# Altium schematic sheet NIR-Spec-Motherboard-SCH_SH3_(02).SchDoc: SCHEMATIC
size 863 x 558 mm; DocumentNumber: NIR-Spec-3; SheetNumber: 3; SheetTotal: 3; PageSetup: Record=PageOptions|CenterHorizontal=True|CenterVertical=True|PrintScale=0.98|XCorrection=1.00|YCorrection=1.00|PrintKind=2|BorderSize=5000000|LeftOffset=0|BottomOffset=0|Orientation=2|PaperLength=1000|PaperWidth=1000|Scale=100|PaperSource=15|PrintQuality=1200|MediaType=1|DitherType=10|PaperKind=11 x 17|PrintScaleMode=1
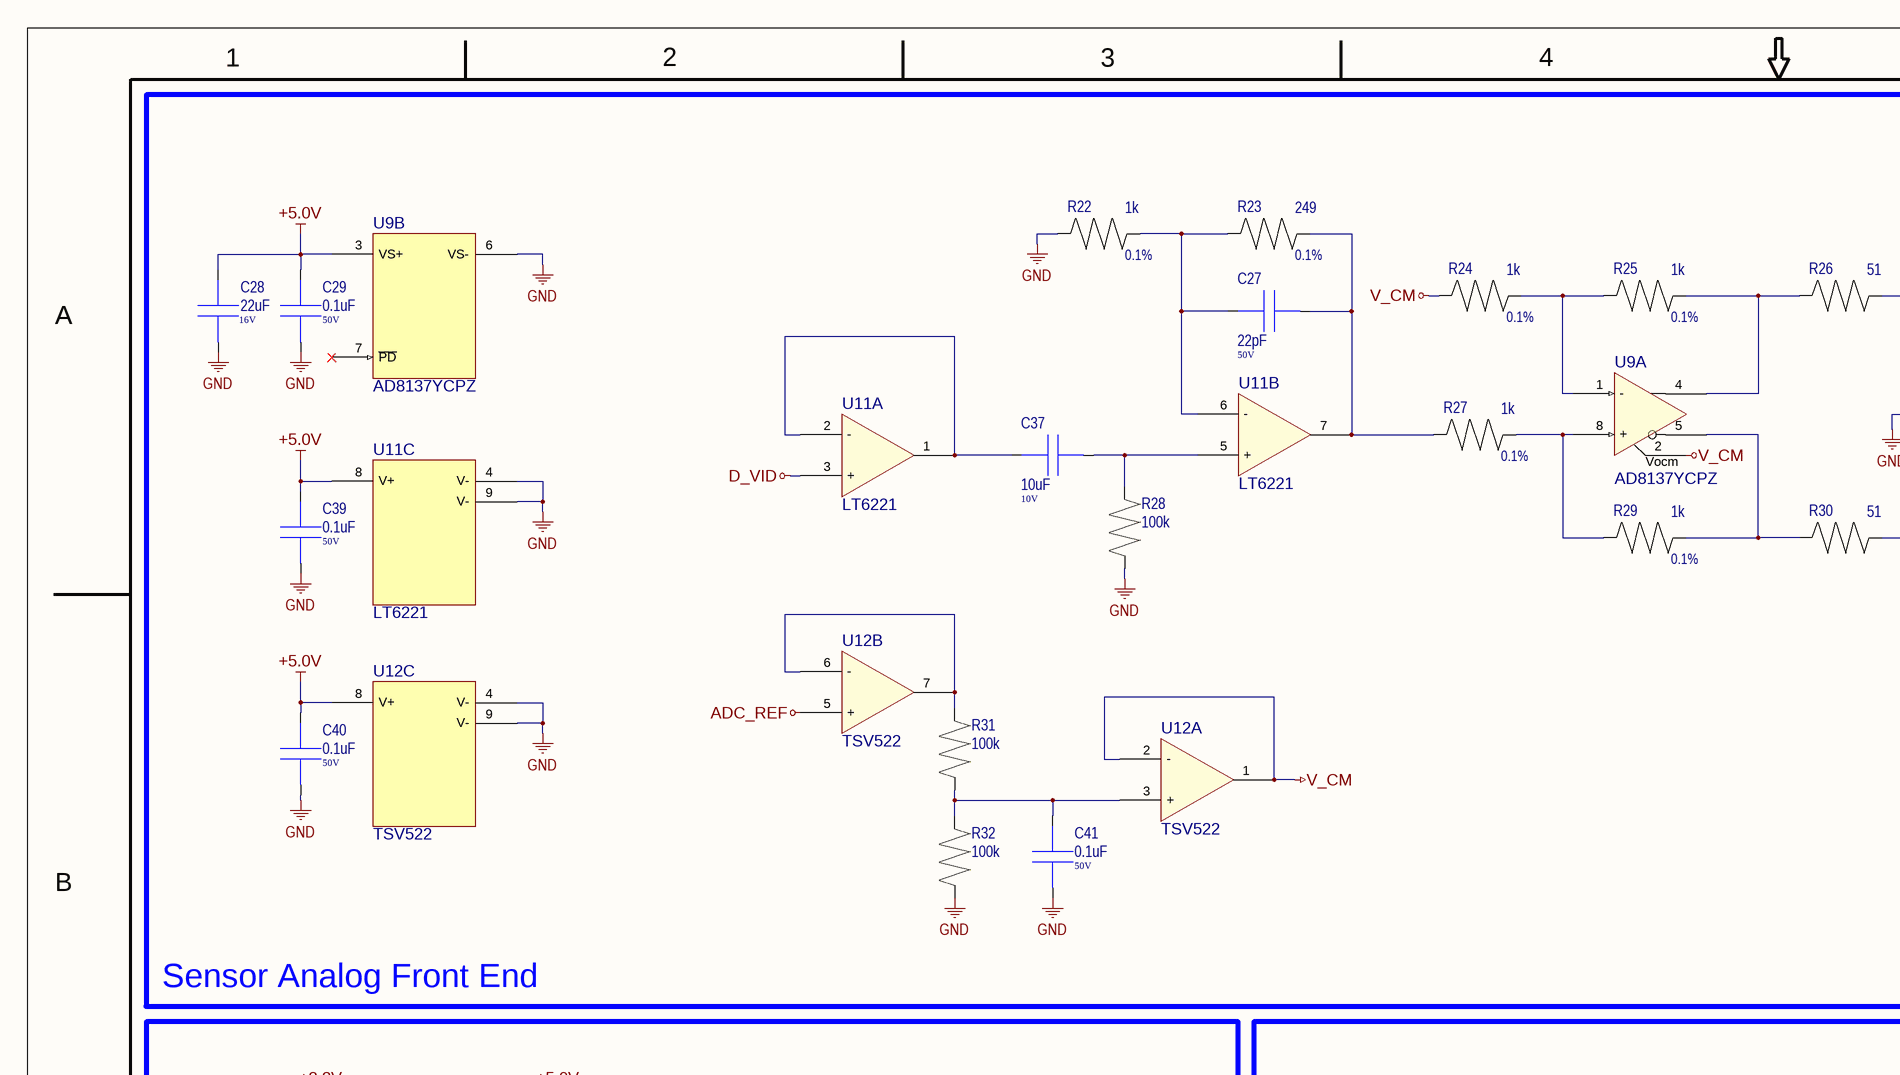
[diagram p0: NIR-Spec-Motherboard-SCH_SH3_(02).SchDoc, top left]
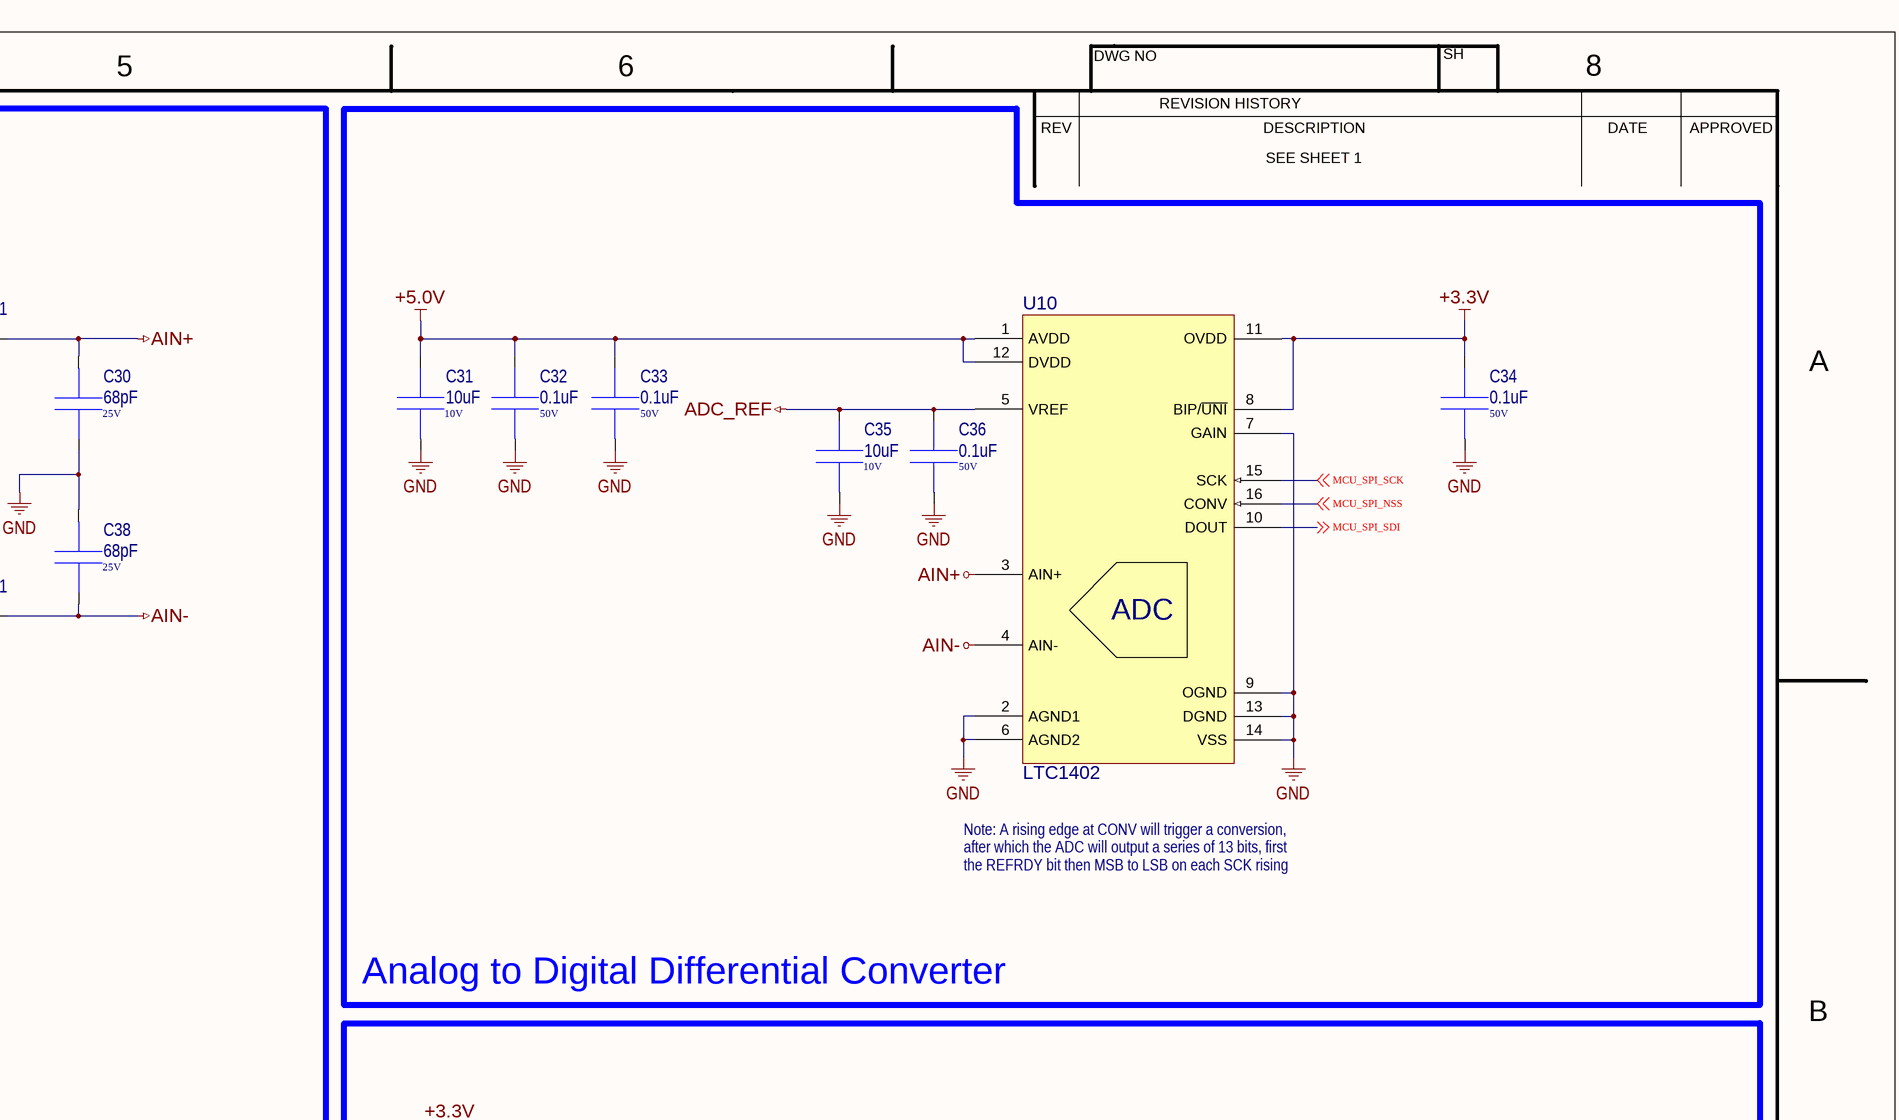
[diagram p1: NIR-Spec-Motherboard-SCH_SH3_(02).SchDoc, top right]
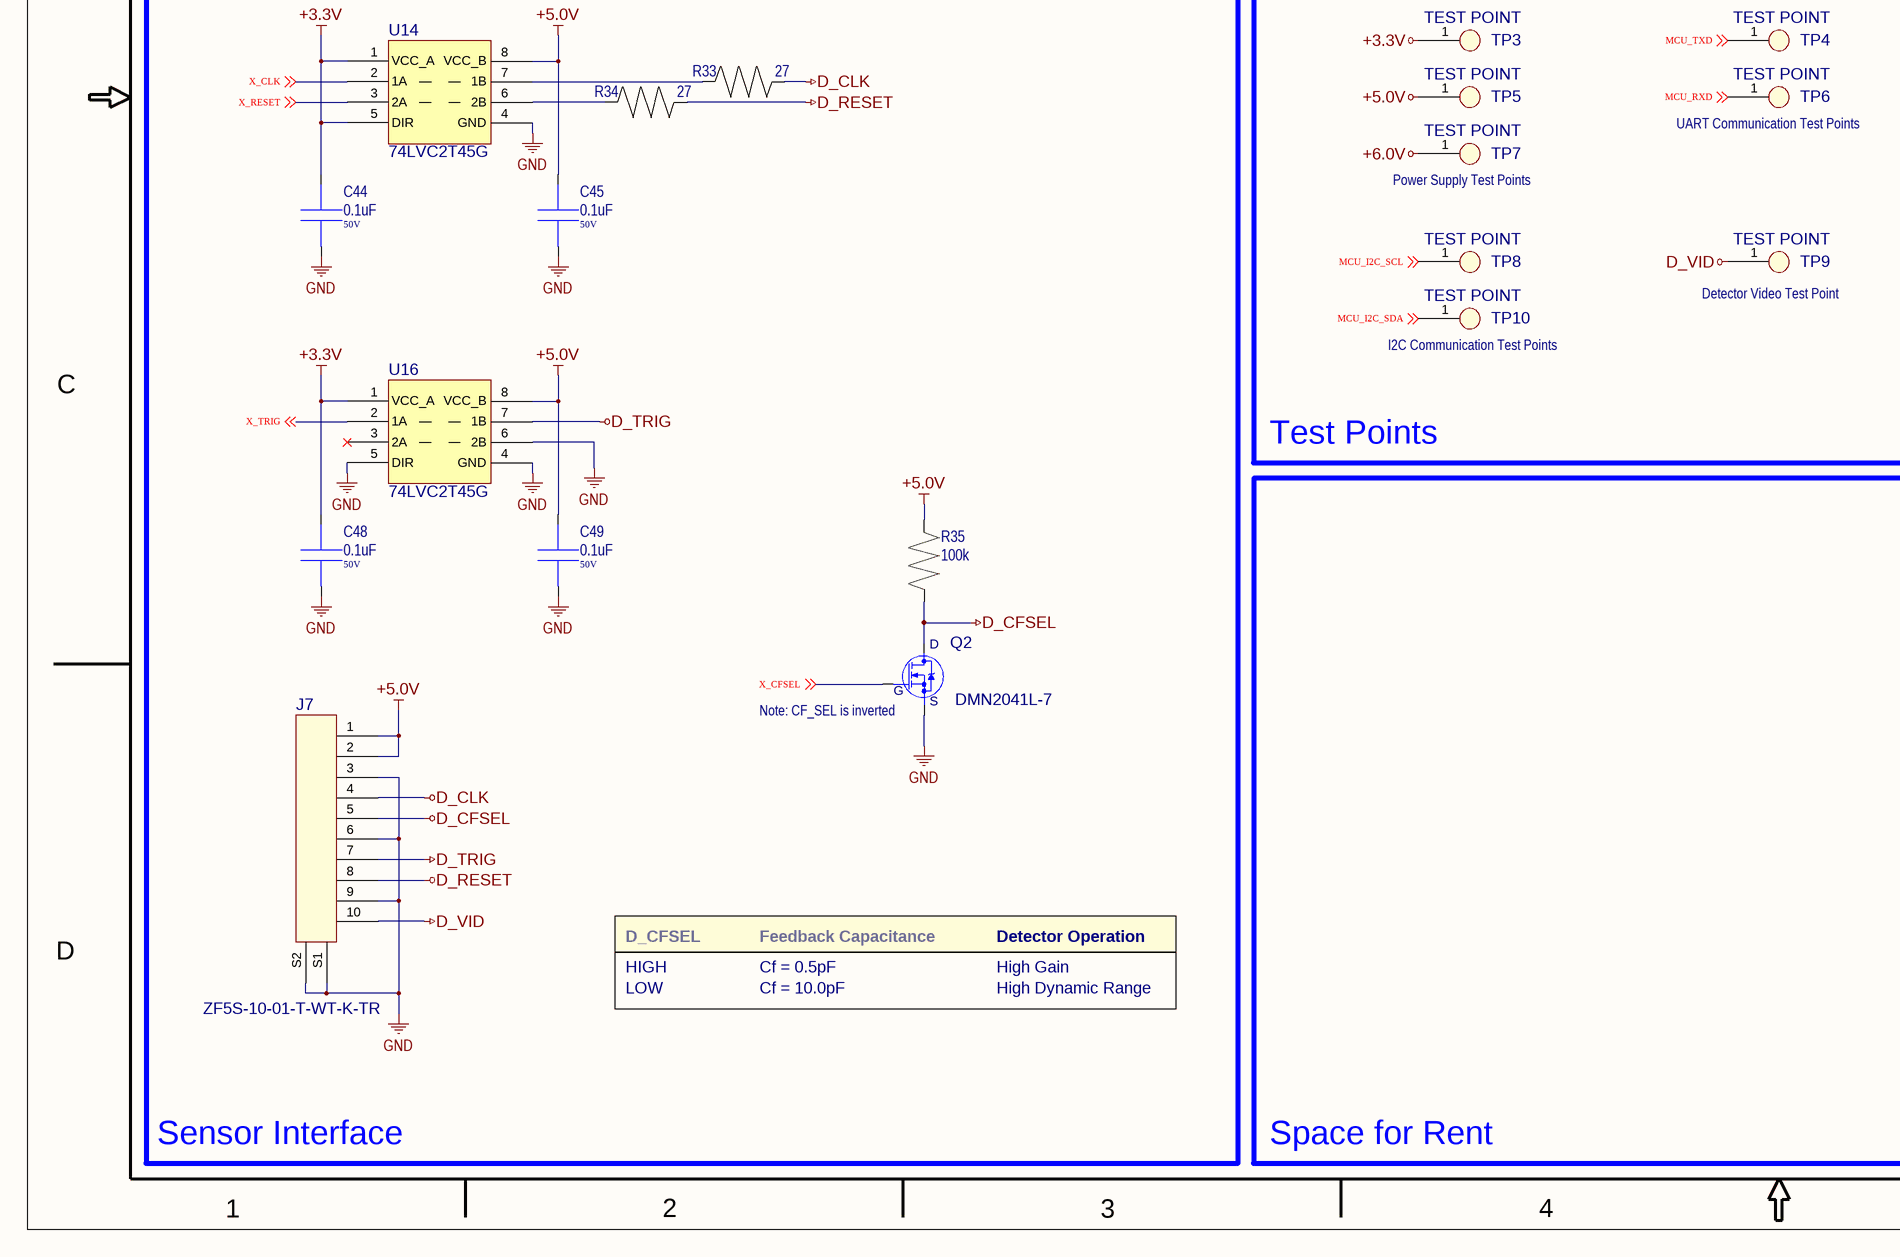
[diagram p2: NIR-Spec-Motherboard-SCH_SH3_(02).SchDoc, bottom left]
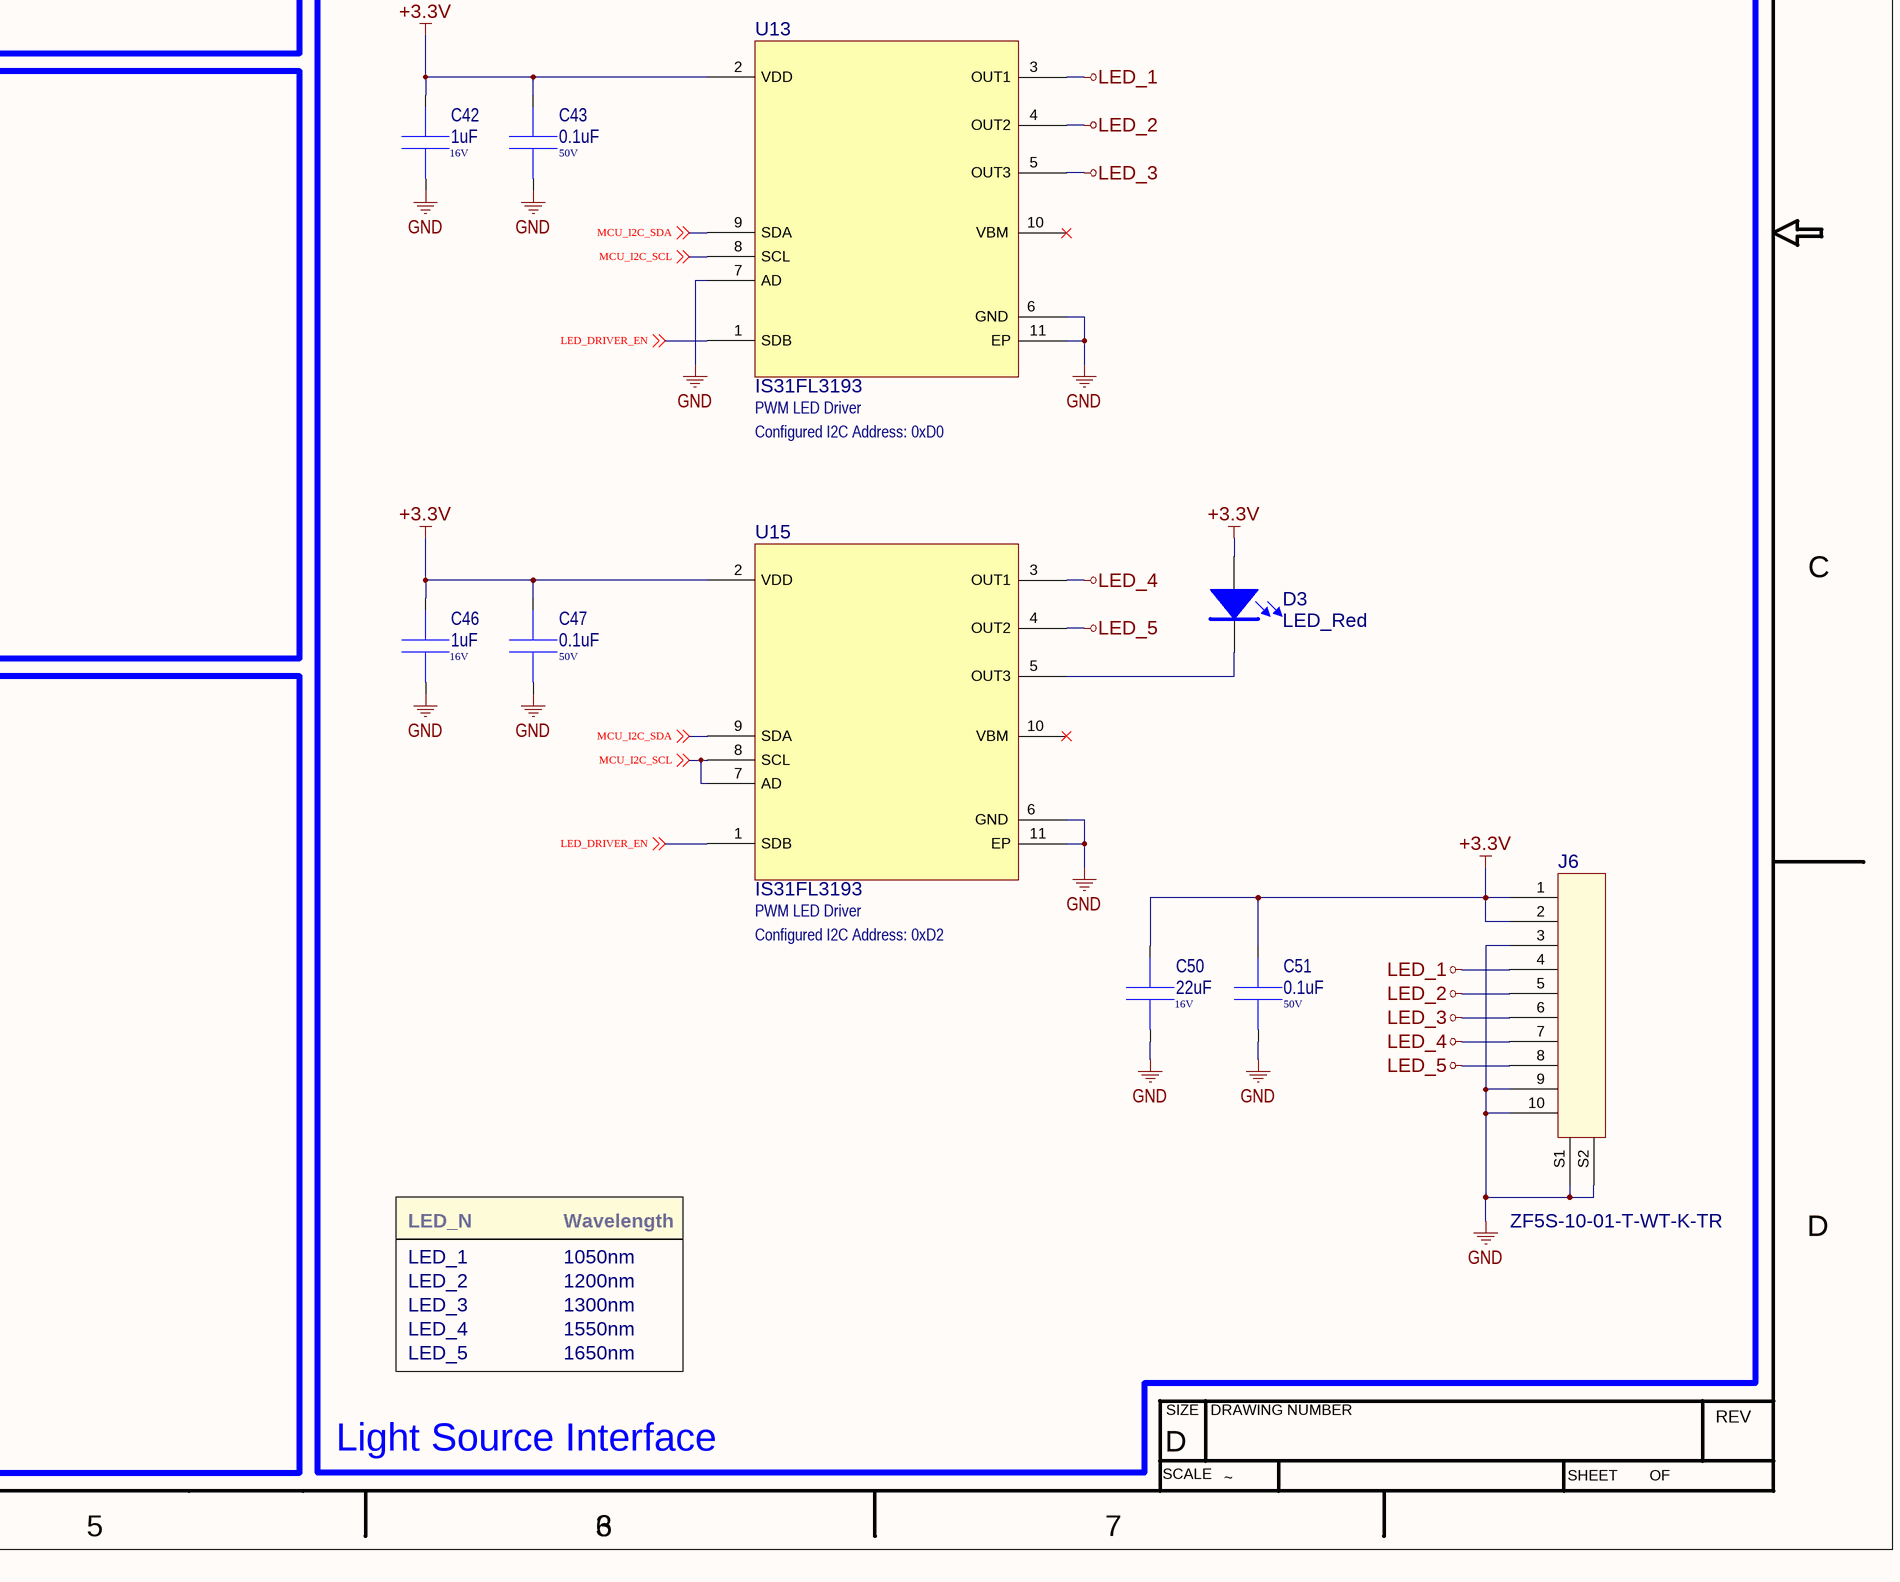
[diagram p3: NIR-Spec-Motherboard-SCH_SH3_(02).SchDoc, bottom right]

## Parts
C27  22pF  Voltage: 50V  [0603]
C28  22uF  Voltage: 16V  [0805]
C29  0.1uF  Voltage: 50V  [0603]
C30  68pF  Voltage: 25V  [0603]
C31  10uF  Voltage: 10V  [0603]
C32  0.1uF  Voltage: 50V  [0603]
C33  0.1uF  Voltage: 50V  [0603]
C34  0.1uF  Voltage: 50V  [0603]
C35  10uF  Voltage: 10V  [0603]
C36  0.1uF  Voltage: 50V  [0603]
C37  10uF  Voltage: 10V  [0603]
C38  68pF  Voltage: 25V  [0603]
C39  0.1uF  Voltage: 50V  [0603]
C40  0.1uF  Voltage: 50V  [0603]
C41  0.1uF  Voltage: 50V  [0603]
C42  1uF  Voltage: 16V  [0603]
C43  0.1uF  Voltage: 50V  [0603]
C44  0.1uF  Voltage: 50V  [0603]
C45  0.1uF  Voltage: 50V  [0603]
C46  1uF  Voltage: 16V  [0603]
C47  0.1uF  Voltage: 50V  [0603]
C48  0.1uF  Voltage: 50V  [0603]
C49  0.1uF  Voltage: 50V  [0603]
C50  22uF  Voltage: 16V  [0805]
C51  0.1uF  Voltage: 50V  [0603]
D3  LED_Red  [0603_LED_Red]
J6  ZF5S-10-01-T-WT-K-TR  [ZF5S-10-01-T-WT-K-TR]
J7  ZF5S-10-01-T-WT-K-TR  [ZF5S-10-01-T-WT-K-TR]
Q2  DMN2041L-7  [SOT-23]
R22  1k  [0603]
R23  249  [0603]
R24  1k  [0603]
R25  1k  [0603]
R26  51  [0603]
R27  1k  [0603]
R28  100k  [0603]
R29  1k  [0603]
R30  51  [0603]
R31  100k  [0603]
R32  100k  [0603]
R33  27  [0603]
R34  27  [0603]
R35  100k  [0603]
TP3  TEST POINT  [30x40 TP]
TP4  TEST POINT  [30x40 TP]
TP5  TEST POINT  [30x40 TP]
TP6  TEST POINT  [30x40 TP]
TP7  TEST POINT  [30x40 TP]
TP8  TEST POINT  [30x40 TP]
TP9  TEST POINT  [30x40 TP]
TP10  TEST POINT  [30x40 TP]
U9  AD8137YCPZ  [SOIC_8]  (parts A,B of 2)
U10  LTC1402  [LTC1402]
U11  LT6221  [DFN-8(3x3)]  (parts A,B,C of 3)
U12  TSV522  [DFN-8 2x2]  (parts A,B,C of 3)
U13  IS31FL3193  [DFN-10]
U14  74LVC2T45G  [SOT-765]
U15  IS31FL3193  [DFN-10]
U16  74LVC2T45G  [SOT-765]

## Blocks framed on the sheet
Sensor Analog Front End: C27-C30 C37-C41 R22-R32 U9 U11 U12
Analog to Digital Differential Converter: C31-C36 U10
Light Source Interface: C42 C43 C46 C47 C50 C51 D3 J6 U13 U15
Sensor Interface: C44 C45 C48 C49 J7 Q2 R33-R35 U14 U16
Test Points: TP3-TP10

## Nets
+3.3V: C34.2 C42.2 C43.2 C44.2 C46.2 C47.2 C48.2 C50.2 C51.2 D3.1(A) J6.1 J6.2 TP3.1 U10.8(BIP/~{UNI}) U10.11(OVDD) U13.2(VDD) U14.1(VCC_A) U14.5(DIR) U15.2(VDD) U16.1(VCC_A)
+5.0V: C28.2 C29.2 C31.2 C32.2 C33.2 C39.2 C40.2 C45.2 C49.2 J7.1 J7.2 R35.1 TP5.1 U9.3(VS+) U10.1(AVDD) U10.12(DVDD) U11.8(V+) U12.8(V+) U14.8(VCC_B) U16.8(VCC_B)
+6.0V: TP7.1
ADC_REF: C35.2 C36.2 U10.5(VREF) U12.5(+)
AIN+: C30.1 R26.2 U10.3(AIN+)
AIN-: C38.2 R30.2 U10.4(AIN-)
D_CFSEL: J7.5 Q2.2(D) R35.2
D_CLK: J7.4 R33.2
D_RESET: J7.8 R34.2
D_TRIG: J7.7 U16.7(1B)
D_VID: J7.10 TP9.1 U11.3(+)
GND: C28.1 C29.1 C30.2 C31.1 C32.1 C33.1 C34.1 C35.1 C36.1 C38.1 C39.1 C40.1 C41.1 C42.1 C43.1 C44.1 C45.1 C46.1 C47.1 C48.1 C49.1 C50.1 C51.1 J6.3 J6.9 J6.10 J6.S1 J6.S2 J7.3 J7.6 J7.9 J7.S1 J7.S2 Q2.3(S) R22.1 R28.2 R32.2 U9.6(VS-) U10.2(AGND1) U10.6(AGND2) U10.7(GAIN) U10.9(OGND) U10.13(DGND) U10.14(VSS) U11.4(V-) U11.9(V-) U12.4(V-) U12.9(V-) U13.6(GND) U13.7(AD) U13.11(EP) U14.4(GND) U15.6(GND) U15.11(EP) U16.4(GND) U16.5(DIR) U16.6(2B)
LED_1: J6.4 U13.3(OUT1)
LED_2: J6.5 U13.4(OUT2)
LED_3: J6.6 U13.5(OUT3)
LED_4: J6.7 U15.3(OUT1)
LED_5: J6.8 U15.4(OUT2)
V_CM: R24.1 U9.2(Vocm) U12.1(OUT) U12.2(-)
LED_DRIVER_EN: U13.1(SDB) U15.1(SDB) ; off-sheet LED_DRIVER_EN
MCU_I2C_SCL: TP8.1 U13.8(SCL) U15.7(AD) U15.8(SCL) ; off-sheet MCU_I2C_SCL
MCU_I2C_SDA: TP10.1 U13.9(SDA) U15.9(SDA) ; off-sheet MCU_I2C_SDA
MCU_RXD: TP6.1 ; off-sheet MCU_RXD
MCU_SPI_NSS: U10.16(CONV) ; off-sheet MCU_SPI_NSS
MCU_SPI_SCK: U10.15(SCK) ; off-sheet MCU_SPI_SCK
MCU_SPI_SDI: U10.10(DOUT) ; off-sheet MCU_SPI_SDI
MCU_TXD: TP4.1 ; off-sheet MCU_TXD
X_CFSEL: Q2.1(G) ; off-sheet X_CFSEL
X_CLK: U14.2(1A) ; off-sheet X_CLK
X_RESET: U14.3(2A) ; off-sheet X_RESET
X_TRIG: U16.2(1A) ; off-sheet X_TRIG
NetC27_1: C27.1 R23.2 R27.1 U11.7(OUT)
NetC27_2: C27.2 R22.2 R23.1 U11.6(-)
NetC37_1: C37.1 R28.1 U11.5(+)
NetC37_2: C37.2 U11.1(OUT) U11.2(-)
NetC41_2: C41.2 R31.2 R32.1 U12.3(+)
NetD3_2: D3.2(K) U15.5(OUT3)
NetR24_2: R24.2 R25.1 U9.1(-)
NetR25_2: R25.2 R26.1 U9.4(OUT+)
NetR27_2: R27.2 R29.1 U9.8(+)
NetR29_2: R29.2 R30.1 U9.5(OUT-)
NetR31_1: R31.1 U12.6(-) U12.7(OUT)
NetR33_1: R33.1 U14.7(1B)
NetR34_1: R34.1 U14.6(2B)

Not connected (* = marked no-connect by the designer): U9 7(~{PD})*; U13 10(VBM)*; U15 10(VBM)*; U16 3(2A)*

## Notes on the sheet
- 1
- 2
- 3
- 4
- 5
- 6
- DWG NO
- REVISION HISTORY
- SH
- 8
- REV
- DESCRIPTION
- SEE SHEET 1
- DATE
- APPROVED
- (near R22) 0.1%
- (near R23) 0.1%
- A
- (near R24) 0.1%
- (near R25) 0.1%
- (near R27) 0.1%
- (near R29) 0.1%
- Note: A rising edge at CONV will trigger a conversion,
- after which the ADC will output a series of 13 bits, first
- the REFRDY bit then MSB to LSB on each SCK rising
- B
- (near TP6) UART Communication Test Points
- (near TP7) Power Supply Test Points
- PWM LED Driver
- (near TP9) Detector Video Test Point
- Configured I2C Address: 0xD0
- (near TP10) I2C Communication Test Points
- C
- (near Q2) Note: CF_SEL is inverted
- Configured I2C Address: 0xD2
- D_CFSEL
- Feedback Capacitance
- Detector Operation
- D
- HIGH
- Cf = 0.5pF
- High Gain
- LED_1
- LED_N
- 1050nm
- Wavelength
- LOW
- Cf = 10.0pF
- High Dynamic Range
- LED_2
- LED_3
- LED_4
- 1200nm
- 1300nm
- 1550nm
- LED_5
- 1650nm
- Space for Rent
- SIZE
- DRAWING NUMBER
- SCALE
- ~
- SHEET        OF
- 7
- (in symbol LTC1402) ADC

## Library data of the parts
C27 = CAP: CAP CER 22PF NP0 50V 0603; Part Number: VJ0603A220KXAAC; Manufacturer: Vishay; ClassName: Analog Front End
C28 C50 = CAP: CAP CER 22UF 16V X5R 0805; Part Number: CL21A226MOCLRNC; Manufacturer: Samsung Electro-Mechanics
  C28: ClassName: Analog Front End
  C50: ClassName: LED Drivers
C29 C32-C34 C36 C39-C41 C43-C45 C47-C49 C51 = CAP: CAP CER 0.1UF 50V X7R 0603; Part Number: C0603C104K5RAC3121; Manufacturer: KEMET
  C29 C39-C41: ClassName: Analog Front End
  C32-C34 C36: ClassName: A/D Converter
  C43 C47 C51: ClassName: LED Drivers
  C44 C45 C48 C49: ClassName: Sensor Interface
C30 C38 = CAP: CAP CER 68PF 25V NP0 0603; Part Number: VJ0603A680KXXPW1BC; Manufacturer: Vishay; ClassName: Analog Front End
C31 C35 C37 = CAP: CAP CER 10UF 10V X6S 0603; Part Number: GRM188C81A106MA73D; Manufacturer: Murata Electronics
  C31 C35: ClassName: A/D Converter
  C37: ClassName: Analog Front End
C42 C46 = CAP: CAP CER 1UF 10V X5R 0603; Part Number: GRM188R61C105KA12J; Manufacturer: Murata Electronics; ClassName: LED Drivers
D3 = LED_Red: Standard LEDs - SMD HE Red 645 nm Water Clear; Part Number: SM0603HCL; Manufacturer: Bivar; ClassName: LED Drivers
J6 J7 = ZF5S-10-01-T-WT-K-TR: Manufacturer: Samtec; Part Number: ZF5S-10-01-T-WT-K-TR
  J6: ClassName: LED Drivers
  J7: ClassName: Sensor Interface
Q2 = MOSFET_N: MOSFET, N CH, 3-PIN; Manufacturer: Diodes Incorporated; Part Number: DMN2041L-7; ClassName: Sensor Interface
R22 R24 R25 R27 R29 = RES: Thin Film Resistors - SMD CPF A 0603 1K0 0.1% 25PPM; Part Number: CPF-A-0603B1K0E; Manufacturer: TE Connectivity; ClassName: Analog Front End
R23 = RES: Thin Film Resistors - SMD 0603 249ohms 25ppm 0.5%; Part Number: ERA-3AED2490V; Manufacturer: Panasonic; ClassName: Analog Front End
R26 R30 = RES: Thin Film Resistors - SMD .1W 51ohm 1% 0603; Part Number: MCT06030C5109FP500; Manufacturer: Vishay; ClassName: Analog Front End
R28 R31 R32 R35 = RES: Thick Film Resistors - SMD 0.33W 100Kohms 5%; Part Number: CRCW0603100KJNEAHP; Manufacturer: Vishay
  R28 R31 R32: ClassName: Analog Front End
  R35: ClassName: Sensor Interface
R33 R34 = RES: Thin Film Resistors - SMD 0603 27ohms 50ppm 0.5%; Part Number: ERA-3AHD270V; Manufacturer: Panasonic; ClassName: Sensor Interface
U9 = AD8137YRZ-Rxxxx: IC OPAMP DIFF 110MHZ RRO 8SOIC; Manufacturer: Analog Devices; Part Number: AD8137YCPZ; ClassName: Analog Front End
U10 = LTC1402: 12 Bit Analog to Digital Converter 1 Input 1 SAR 16-SSOP; Manufacturer: Linear Technology; Part Number: LTC1402; ClassName: A/D Converter
U11 = LT6221xDD#TRPBF: IC OPAMP GP 2 CIRCUIT 8DFN; Manufacturer: Linear Technology; Part Number: LT6221xDD#TRPBF; ClassName: Analog Front End
U12 = TSV522: IC CMOS 2 CIRCUIT 8DFN; Manufacturer: ST Microelectronics; Part Number: TSV522IQ2T; ClassName: Analog Front End
U13 U15 = IS31FL3193: IC LED DRIVER LINEAR 42MA 10DFN; Manufacturer: Lumissil Microsystems; Part Number: IS31FL3193-DLS2-TR; ClassName: LED Drivers
U14 U16 = 74LVC2T45G: IC TRNSLTR BIDIRECTIONAL 8XSON; Manufacturer: Nexperia USA; Part Number: 74LVC2T45DC,115; ClassName: Sensor Interface
TP3-TP10 = TEST POINT: ClassName: Test Points